# Altium schematic sheet Sheet3.SchDoc
size 209 x 297 mm; Razrabotal: {Разработал}; Prov: {Проверил}; Tkont: {Т. конт.}; Nkont: {Н. конт.}; Utv: {Утвердил}; Naimenovanie: {Наименование}; Oboznachenie: {Обозначение}; Shifr: {Шифр}
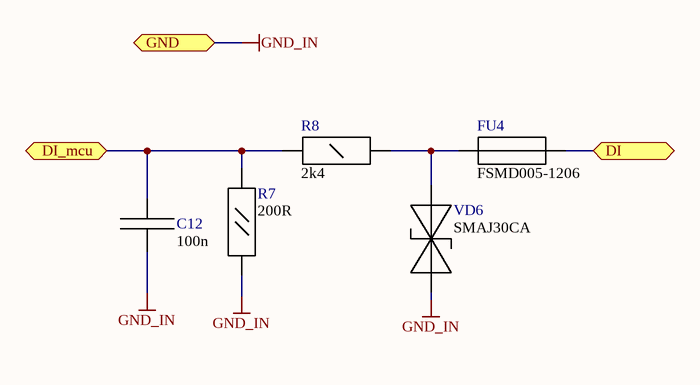
[diagram p0: Sheet3.SchDoc]

## Parts
C12  100n  [Cap Ceramic 0805]
FU4  FSMD005-1206  [Fuse 1206]
R7  200R  [Resistor 0805]
R8  2k4  [Resistor 1206]
VD6  SMAJ30CA  [DO-214AC SMA]

## Ports
DI, DI_mcu, GND

## Nets
GND_IN: C12.2 R7.1 VD6.1 ; port GND
DI: FU4.1 ; port DI
DI_mcu: C12.1 R7.2 R8.1 ; port DI_mcu
NetFU4_2: FU4.2 R8.2 VD6.2

## Notes on the sheet
- Перв. примен.
- Спра. №
- Подп. и дата
- Инв. № бубл.
- Взам. инв. №
- Инв. № подл.
- Лист
- Изм
- № докум.
- Подпись
- Дата
- Копировал
- Формат А4

## Library data of the parts
C12 = Capacitor Nonpolar: Comments: *
FU4 = FSMDxxx-1206: Comments: *
R7 = Resistor 0,125W: Comments: *
R8 = Resistor 0,25W: Comments: *
VD6 = SMAJxxCA: Comments: *